# Altium schematic sheet BoardB-LEDs.SchDoc
size A; SheetNumber: 8; SheetTotal: 9
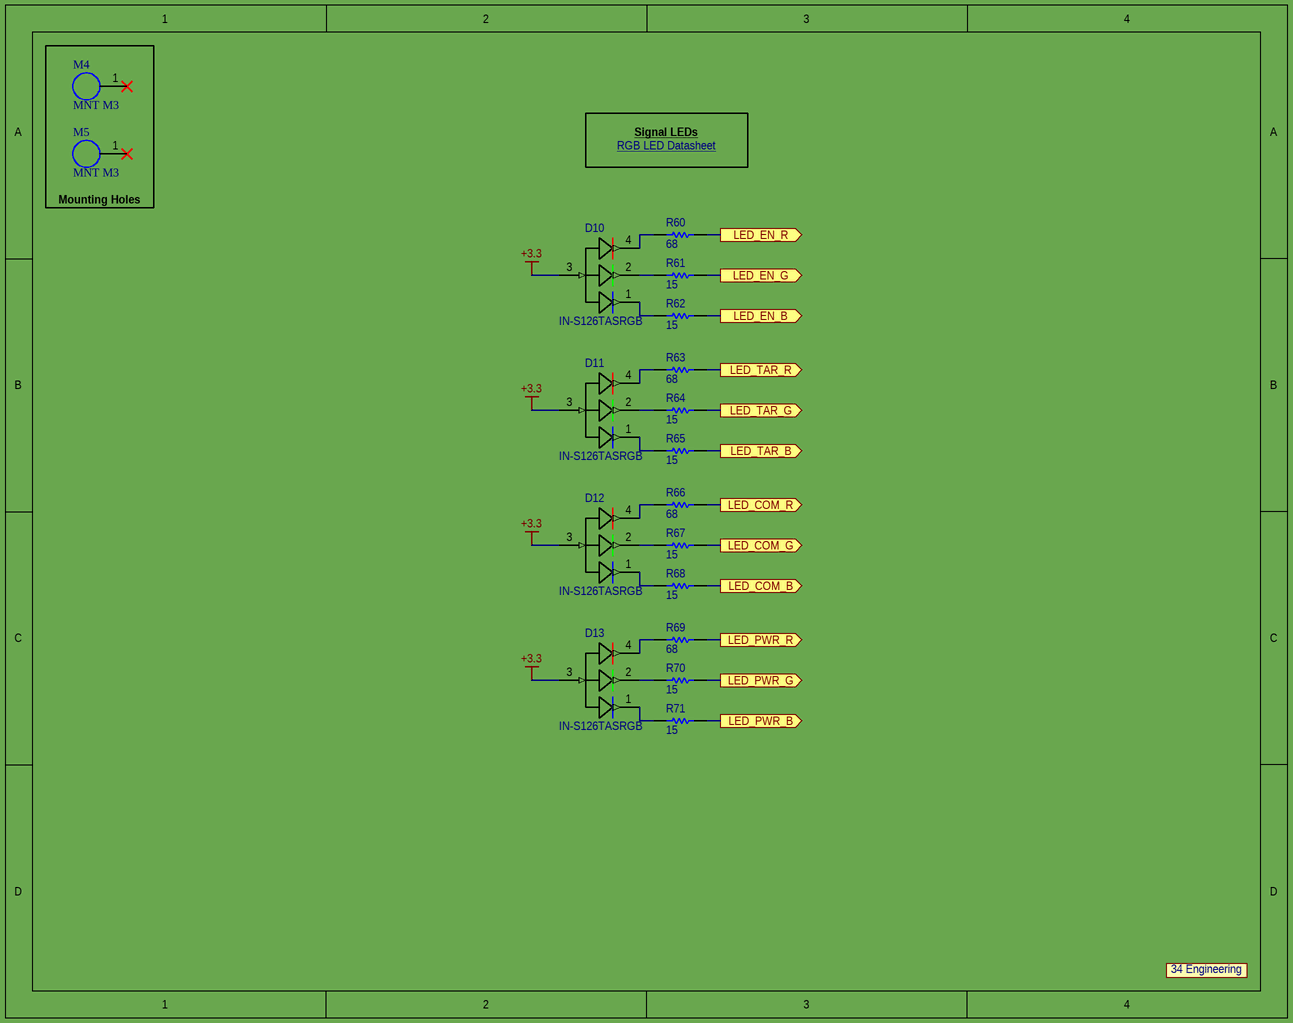
[diagram p0: BoardB-LEDs.SchDoc]

## Parts
D10  IN-S126TASRGB  [IN-S126TASRGB]
D11  IN-S126TASRGB  [IN-S126TASRGB]
D12  IN-S126TASRGB  [IN-S126TASRGB]
D13  IN-S126TASRGB  [IN-S126TASRGB]
LOGO1  34 Engineering Logo  [34EngineeringLogo]  (value not drawn)
M4  MNT M3  [MNT M3]
M5  MNT M3  [MNT M3]
R60  68  [RESC1005X40X25ML05T05]
R61  15  [RESC1005X40X25LL05T05]
R62  15  [RESC1005X40X25LL05T05]
R63  68  [RESC1005X40X25ML05T05]
R64  15  [RESC1005X40X25LL05T05]
R65  15  [RESC1005X40X25LL05T05]
R66  68  [RESC1005X40X25ML05T05]
R67  15  [RESC1005X40X25LL05T05]
R68  15  [RESC1005X40X25LL05T05]
R69  68  [RESC1005X40X25ML05T05]
R70  15  [RESC1005X40X25LL05T05]
R71  15  [RESC1005X40X25LL05T05]

## Blocks framed on the sheet
Mounting Holes: M4 M5

## Ports
LED_COM_B (out), LED_COM_G (out), LED_COM_R (out), LED_EN_B (out), LED_EN_G (out), LED_EN_R (out), LED_PWR_B (out), LED_PWR_G (out), LED_PWR_R (out), LED_TAR_B (out), LED_TAR_G (out), LED_TAR_R (out)

## Nets
+3.3: D10.3 D11.3 D12.3 D13.3
LED_COM_B: R68.2 ; port LED_COM_B
LED_COM_G: R67.2 ; port LED_COM_G
LED_COM_R: R66.2 ; port LED_COM_R
LED_EN_B: R62.2 ; port LED_EN_B
LED_EN_G: R61.2 ; port LED_EN_G
LED_EN_R: R60.2 ; port LED_EN_R
LED_PWR_B: R71.2 ; port LED_PWR_B
LED_PWR_G: R70.2 ; port LED_PWR_G
LED_PWR_R: R69.2 ; port LED_PWR_R
LED_TAR_B: R65.2 ; port LED_TAR_B
LED_TAR_G: R64.2 ; port LED_TAR_G
LED_TAR_R: R63.2 ; port LED_TAR_R
NetD10_1: D10.1 R62.1
NetD10_2: D10.2 R61.1
NetD10_4: D10.4 R60.1
NetD11_1: D11.1 R65.1
NetD11_2: D11.2 R64.1
NetD11_4: D11.4 R63.1
NetD12_1: D12.1 R68.1
NetD12_2: D12.2 R67.1
NetD12_4: D12.4 R66.1
NetD13_1: D13.1 R71.1
NetD13_2: D13.2 R70.1
NetD13_4: D13.4 R69.1

Not connected (* = marked no-connect by the designer): M4 1*; M5 1*

## Notes on the sheet
- Signal LEDs
- RGB LED Datasheet <http://www.inolux-corp.com/datasheet/SMDLED/RGB%20Side%20View/IN-S126TASRGB_V1.1.pdf>
- (in symbol 34EngineeringLogo) 34 Engineering

## Library data of the parts
D10-D13 = IN-S126TASRGB: LED Tri-Color Blue/Green/Red 470nm/523nm/625nm Automotive 4-Pin Chip 1206(3216Metric) T/R; Manufacturer: Inolux; Supplier 1: Digi-Key; Manufacturer Part Number: IN-S126TASRGB; RoHS: No; Category: LEDs; Stock 1: 49322; Pricing 1: 1=0.58000, 10=0.37900, 100=0.25070, 1000=0.19356 (USD); Supplier Part Number 1: 1830-1052-1-ND
LOGO1 = 34EngineeringLogo: 34 Engineering Silkscreen Logo
M4 M5 = MNT M3: Mounting hole for an M3 bolt
R60 R63 R66 R69 = CMP-2002-01170-1: Manufacturer: Panasonic; Part Number: ERJ2RKF68R0X
R61 R62 R64 R65 R67 R68 R70 R71 = CMP-1011-00302-2: Manufacturer: Panasonic; Part Number: ERJ-2RKF15R0X